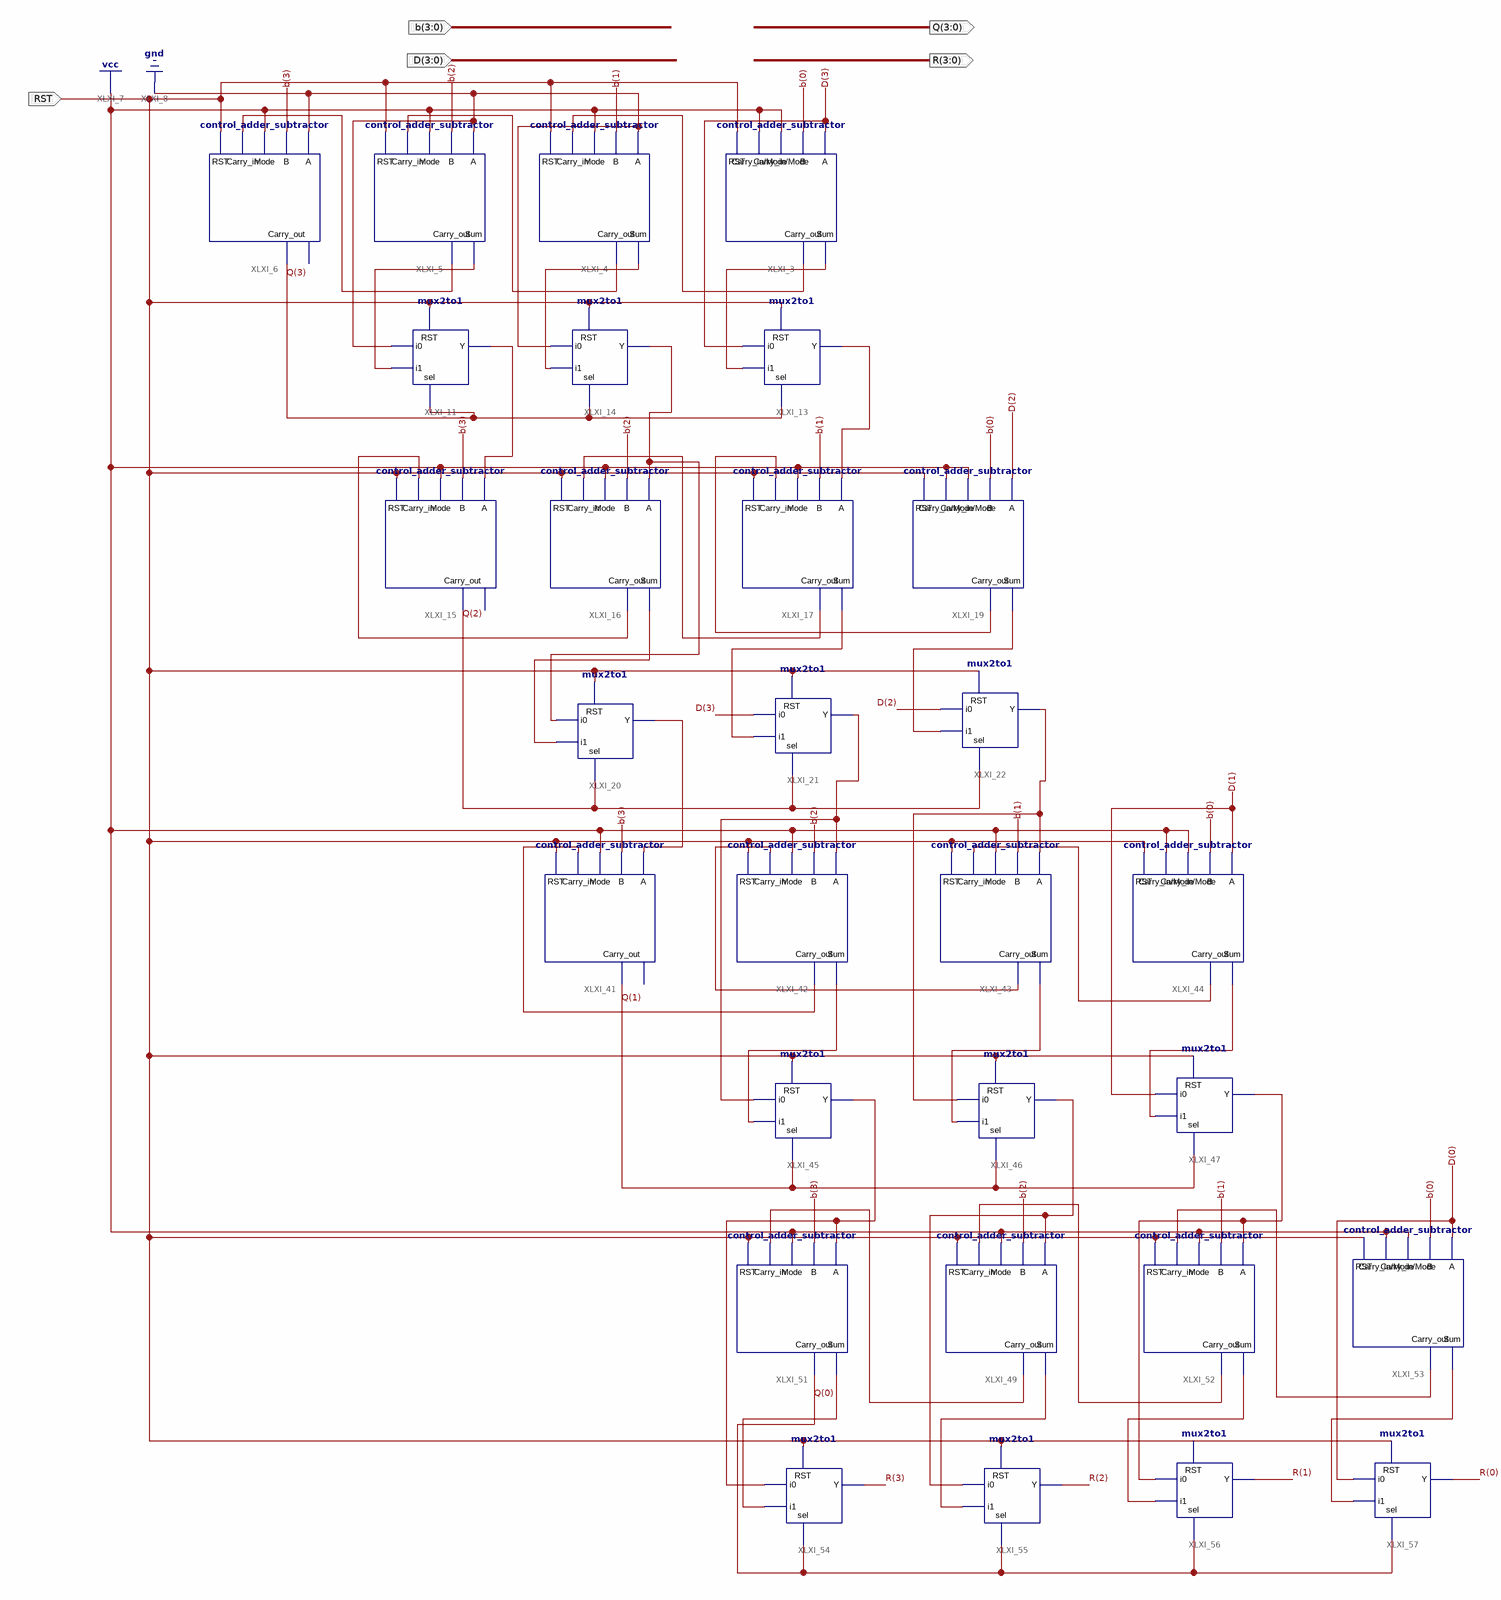
[diagram p0: schematic sheet 1]
// Xilinx ISE schematic divider4.sch (artix7) as structural Verilog: 29 symbols, 5 ports
module divider4 (
  input  RST,
  input  [3:0] D,
  input  [3:0] b,
  output [3:0] R,
  output [3:0] Q
);

  wire XLXN_17, XLXN_18, XLXN_22, XLXN_46, XLXN_47, XLXN_48, XLXN_71, XLXN_73, XLXN_82, XLXN_83, XLXN_84,
       XLXN_92, XLXN_93, XLXN_94, XLXN_158, XLXN_159, XLXN_160, XLXN_166, XLXN_167, XLXN_168, XLXN_188,
       XLXN_189, XLXN_191, XLXN_199, XLXN_200, XLXN_201, XLXN_202, XLXN_203, XLXN_204, XLXN_205, XLXN_220,
       XLXN_227, XLXN_238, XLXN_240;

  mux2to1 XLXI_22 (.i0(D[2]), .i1(XLXN_94), .RST(RST), .sel(Q[2]), .Y(XLXN_240));
  mux2to1 XLXI_21 (.i0(D[3]), .i1(XLXN_93), .RST(RST), .sel(Q[2]), .Y(XLXN_238));
  control_adder_subtractor XLXI_19 (
    .A(D[2]), .B(b[0]), .Carry_out(XLXN_84), .Carry_in(1'b1), .Mode(1'b1), .RST(RST), .Sum(XLXN_94));
  control_adder_subtractor XLXI_17 (
    .A(XLXN_73), .B(b[1]), .Carry_out(XLXN_83), .Carry_in(XLXN_84), .Mode(1'b1), .RST(RST), .Sum(XLXN_93));
  control_adder_subtractor XLXI_16 (
    .A(XLXN_220), .B(b[2]), .Carry_out(XLXN_82), .Carry_in(XLXN_83), .Mode(1'b1), .RST(RST), .Sum(XLXN_92));
  control_adder_subtractor XLXI_15 (
    .A(XLXN_71), .B(b[3]), .Carry_out(Q[2]), .Carry_in(XLXN_82), .Mode(1'b1), .RST(RST));  // open: Sum
  control_adder_subtractor XLXI_3 (
    .A(D[3]), .B(b[0]), .Carry_out(XLXN_22), .Carry_in(1'b1), .Mode(1'b1), .RST(RST), .Sum(XLXN_48));
  control_adder_subtractor XLXI_6 (
    .A(1'b0), .B(b[3]), .Carry_out(Q[3]), .Carry_in(XLXN_17), .Mode(1'b1), .RST(RST));  // open: Sum
  control_adder_subtractor XLXI_5 (
    .A(1'b0), .B(b[2]), .Carry_out(XLXN_17), .Carry_in(XLXN_18), .Mode(1'b1), .RST(RST), .Sum(XLXN_46));
  control_adder_subtractor XLXI_4 (
    .A(1'b0), .B(b[1]), .Carry_out(XLXN_18), .Carry_in(XLXN_22), .Mode(1'b1), .RST(RST), .Sum(XLXN_47));
  control_adder_subtractor XLXI_42 (
    .A(XLXN_238), .B(b[2]), .Carry_out(XLXN_158), .Carry_in(XLXN_159), .Mode(1'b1), .RST(RST), .Sum(XLXN_166));
  control_adder_subtractor XLXI_43 (
    .A(XLXN_240), .B(b[1]), .Carry_out(XLXN_159), .Carry_in(XLXN_160), .Mode(1'b1), .RST(RST), .Sum(XLXN_167));
  control_adder_subtractor XLXI_44 (
    .A(D[1]), .B(b[0]), .Carry_out(XLXN_160), .Carry_in(1'b1), .Mode(1'b1), .RST(RST), .Sum(XLXN_168));
  mux2to1 XLXI_45 (.i0(XLXN_238), .i1(XLXN_166), .RST(RST), .sel(Q[1]), .Y(XLXN_203));
  mux2to1 XLXI_46 (.i0(XLXN_240), .i1(XLXN_167), .RST(RST), .sel(Q[1]), .Y(XLXN_204));
  mux2to1 XLXI_47 (.i0(D[1]), .i1(XLXN_168), .RST(RST), .sel(Q[1]), .Y(XLXN_205));
  control_adder_subtractor XLXI_49 (
    .A(XLXN_204), .B(b[2]), .Carry_out(XLXN_191), .Carry_in(XLXN_189), .Mode(1'b1), .RST(RST), .Sum(XLXN_200));
  control_adder_subtractor XLXI_51 (
    .A(XLXN_203), .B(b[3]), .Carry_out(Q[0]), .Carry_in(XLXN_191), .Mode(1'b1), .RST(RST), .Sum(XLXN_199));
  control_adder_subtractor XLXI_52 (
    .A(XLXN_205), .B(b[1]), .Carry_out(XLXN_189), .Carry_in(XLXN_188), .Mode(1'b1), .RST(RST), .Sum(XLXN_201));
  control_adder_subtractor XLXI_53 (
    .A(D[0]), .B(b[0]), .Carry_out(XLXN_188), .Carry_in(1'b1), .Mode(1'b1), .RST(RST), .Sum(XLXN_202));
  mux2to1 XLXI_54 (.i0(XLXN_203), .i1(XLXN_199), .RST(RST), .sel(Q[0]), .Y(R[3]));
  mux2to1 XLXI_55 (.i0(XLXN_204), .i1(XLXN_200), .RST(RST), .sel(Q[0]), .Y(R[2]));
  mux2to1 XLXI_56 (.i0(XLXN_205), .i1(XLXN_201), .RST(RST), .sel(Q[0]), .Y(R[1]));
  mux2to1 XLXI_57 (.i0(D[0]), .i1(XLXN_202), .RST(RST), .sel(Q[0]), .Y(R[0]));
  mux2to1 XLXI_13 (.i0(D[3]), .i1(XLXN_48), .RST(RST), .sel(Q[3]), .Y(XLXN_73));
  mux2to1 XLXI_20 (.i0(XLXN_220), .i1(XLXN_92), .RST(RST), .sel(Q[2]), .Y(XLXN_227));
  control_adder_subtractor XLXI_41 (
    .A(XLXN_227), .B(b[3]), .Carry_out(Q[1]), .Carry_in(XLXN_158), .Mode(1'b1), .RST(RST));  // open: Sum
  mux2to1 XLXI_14 (.i0(1'b0), .i1(XLXN_47), .RST(RST), .sel(Q[3]), .Y(XLXN_220));
  mux2to1 XLXI_11 (.i0(1'b0), .i1(XLXN_46), .RST(RST), .sel(Q[3]), .Y(XLXN_71));
endmodule
